# Altium project ImageSignalProcessor.PrjPcb
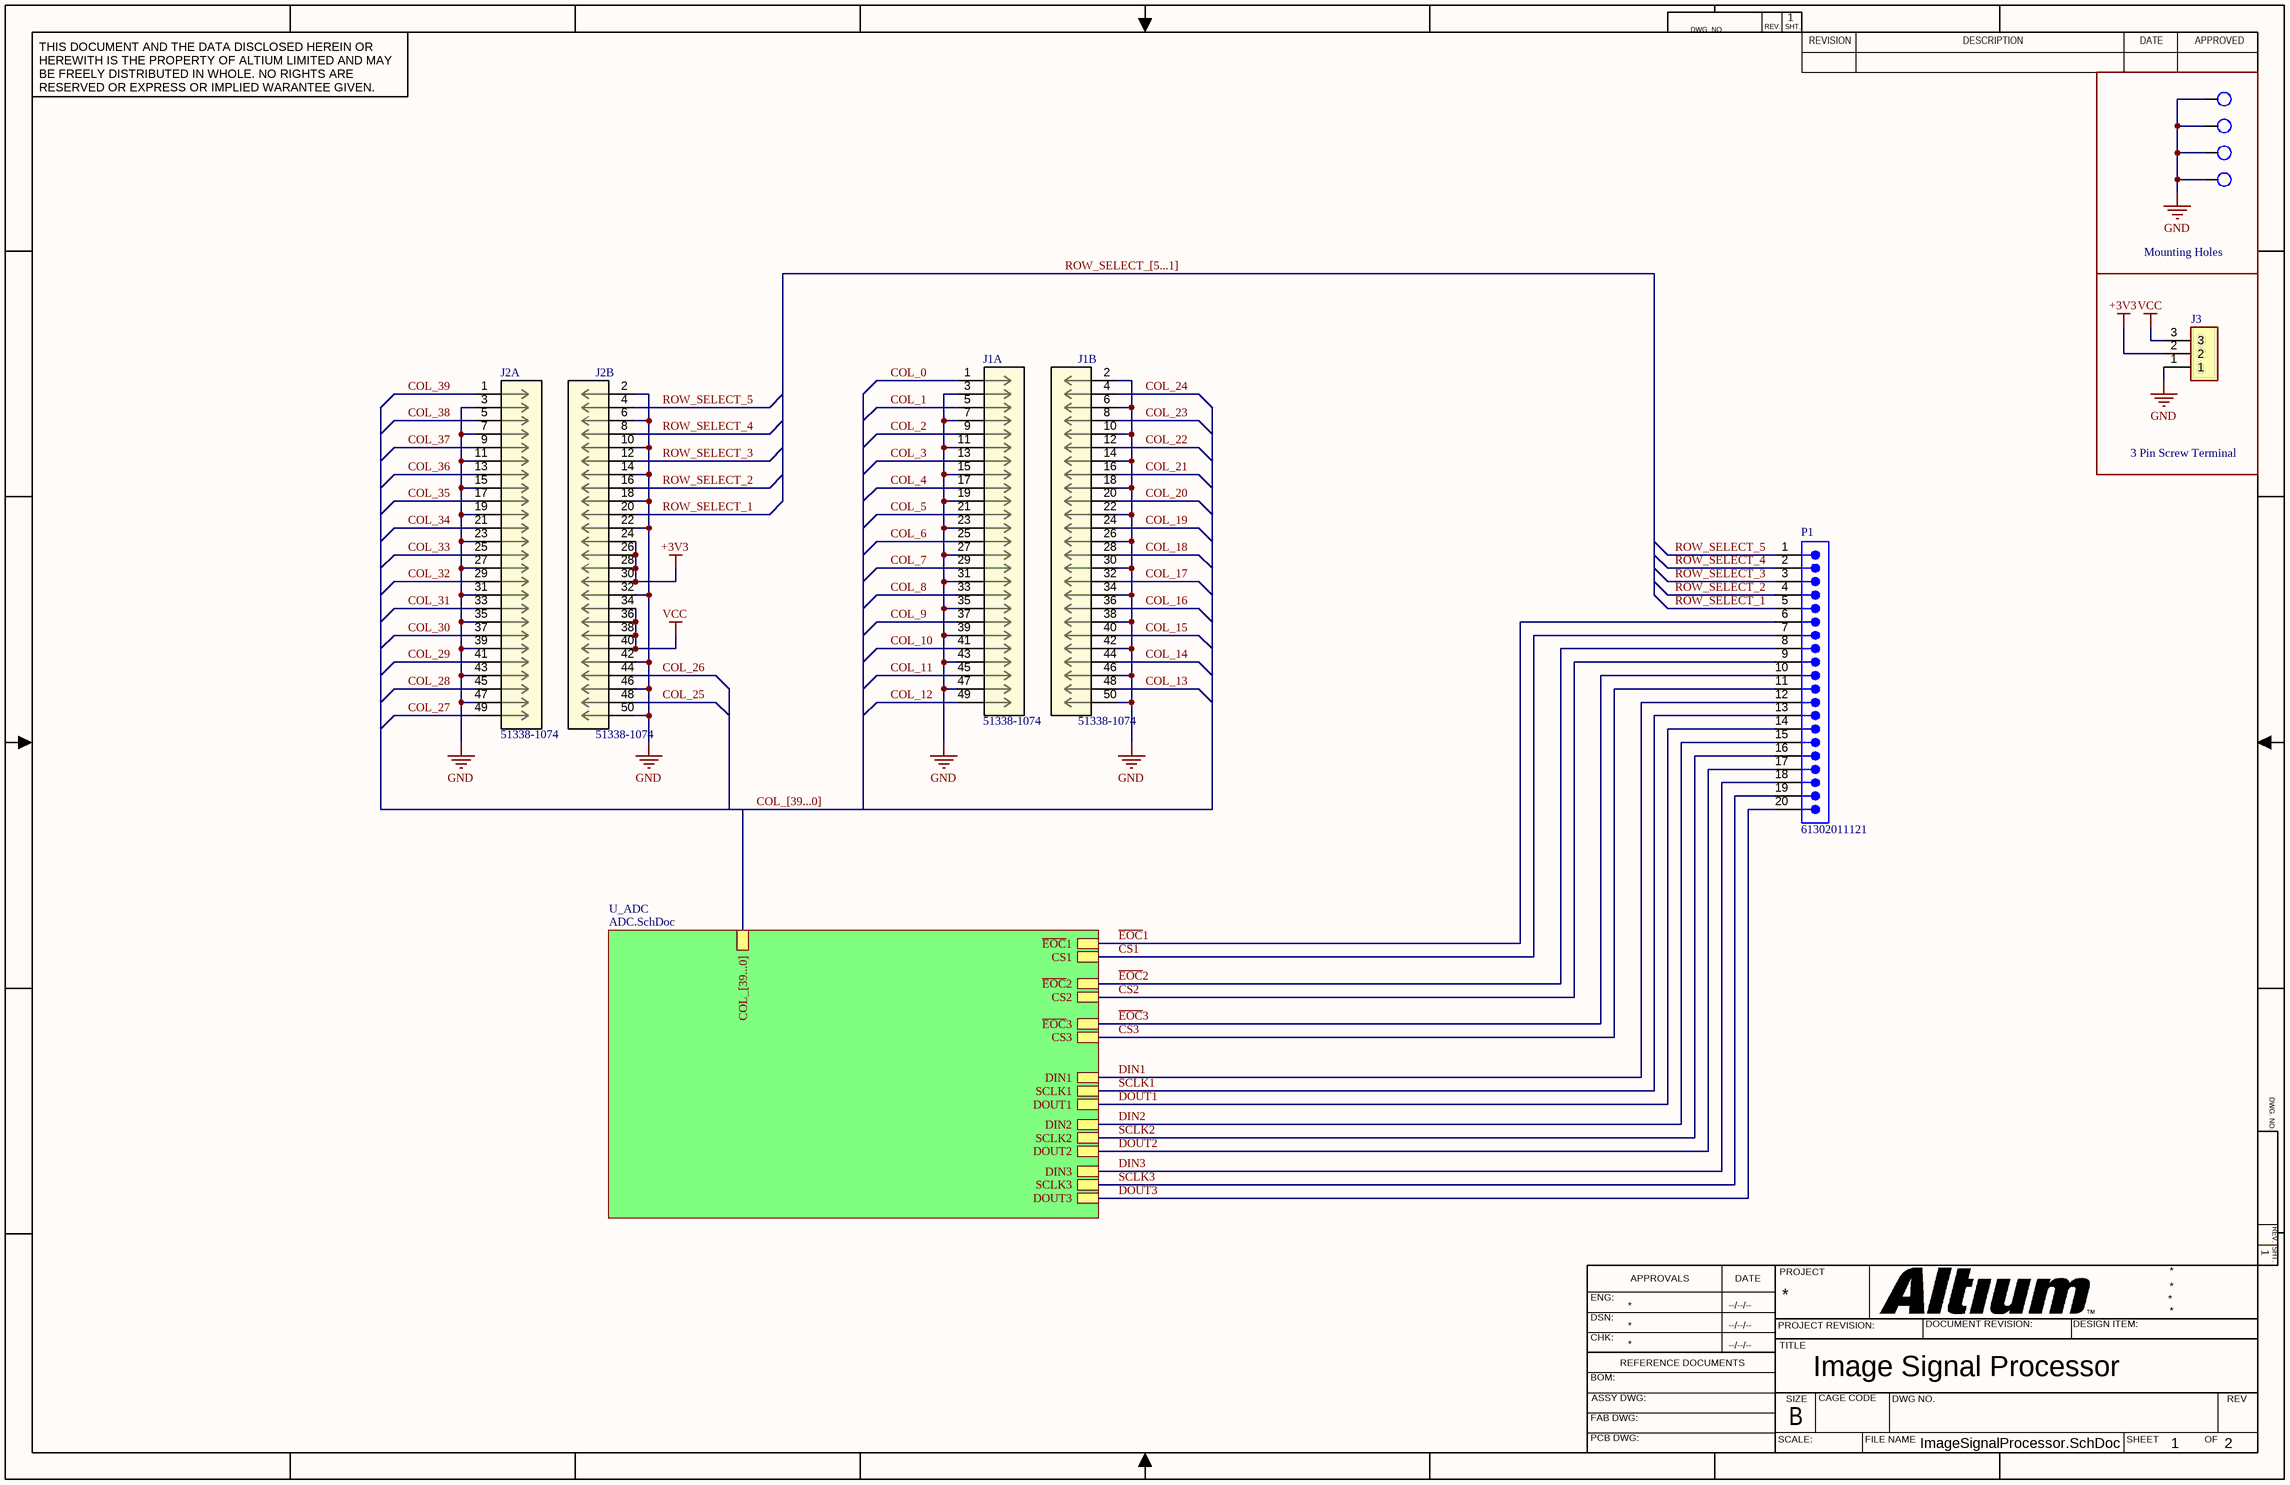
[diagram p0: ImageSignalProcessor.SchDoc]
2 sheets, 17 parts. Net scope: global (net labels, ports and power ports of the same name join across sheets).
Board file: ImageSignalProcessor.PcbDoc
Sheets:
  ImageSignalProcessor.SchDoc
    U_ADC = ADC.SchDoc

## Sheet ImageSignalProcessor.SchDoc: Image Signal Processor
size 431 x 279 mm; Date: 9/19/2023; Revision: 1; SheetNumber: 1; SheetTotal: 2; ENG_APP_DATE: --/--/--; DSN_APP_DATE: --/--/--; CHK_APP_DATE: --/--/--

### Parts
J1  51338-1074  [51338-1074]  (parts A,B of 2)
J2  51338-1074  [51338-1074]  (parts A,B of 2)
J3  3 Pin Screw Terminal  [TE_282837-3]  (value not drawn)
MP1  M3 MOUNTING HOLE  [M3 MOUNTING HOLE]  (value not drawn)
MP2  M3 MOUNTING HOLE  [M3 MOUNTING HOLE]  (value not drawn)
MP3  M3 MOUNTING HOLE  [M3 MOUNTING HOLE]  (value not drawn)
MP4  M3 MOUNTING HOLE  [M3 MOUNTING HOLE]  (value not drawn)
P1  61302011121  [61302011121]

### Blocks framed on the sheet
Mounting Holes: MP1-MP4
3 Pin Screw Terminal: J3

### Sub-sheets
U_ADC = ADC.SchDoc: COL_[39...0], ~{EOC}1, ~{EOC}2, ~{EOC}3, CS1, CS2, CS3, DIN1, SCLK1, DOUT1, DIN2, SCLK2, DOUT2, DIN3, SCLK3, DOUT3

### Nets
+3V3: J2.24 J2.26 J2.28 J2.30 J3.2
GND: J1.2 J1.3 J1.6 J1.7 J1.10 J1.11 J1.14 J1.15 J1.18 J1.19 J1.22 J1.23 J1.26 J1.27 J1.30 J1.31 J1.34 J1.35 J1.38 J1.39 J1.42 J1.43 J1.46 J1.47 J1.50 J2.2 J2.3 J2.6 J2.7 J2.10 J2.11 J2.14 J2.15 J2.18 J2.19 J2.22 J2.23 J2.27 J2.31 J2.32 J2.35 J2.39 J2.42 J2.43 J2.46 J2.47 J2.50 J3.1 MP1.1 MP2.1 MP3.1 MP4.1
VCC: J2.34 J2.36 J2.38 J2.40 J3.3
~{EOC}1: P1.6 ; sheet U_ADC/~{EOC}1
~{EOC}2: P1.8 ; sheet U_ADC/~{EOC}2
~{EOC}3: P1.10 ; sheet U_ADC/~{EOC}3
COL_0: J1.1
COL_1: J1.5
COL_2: J1.9
COL_3: J1.13
COL_4: J1.17
COL_5: J1.21
COL_6: J1.25
COL_7: J1.29
COL_8: J1.33
COL_9: J1.37
COL_10: J1.41
COL_11: J1.45
COL_12: J1.49
COL_13: J1.48
COL_14: J1.44
COL_15: J1.40
COL_16: J1.36
COL_17: J1.32
COL_18: J1.28
COL_19: J1.24
COL_20: J1.20
COL_21: J1.16
COL_22: J1.12
COL_23: J1.8
COL_24: J1.4
COL_25: J2.48
COL_26: J2.44
COL_27: J2.49
COL_28: J2.45
COL_29: J2.41
COL_30: J2.37
COL_31: J2.33
COL_32: J2.29
COL_33: J2.25
COL_34: J2.21
COL_35: J2.17
COL_36: J2.13
COL_37: J2.9
COL_38: J2.5
COL_39: J2.1
CS1: P1.7 ; sheet U_ADC/CS1
CS2: P1.9 ; sheet U_ADC/CS2
CS3: P1.11 ; sheet U_ADC/CS3
DIN1: P1.12 ; sheet U_ADC/DIN1
DIN2: P1.15 ; sheet U_ADC/DIN2
DIN3: P1.18 ; sheet U_ADC/DIN3
DOUT1: P1.14 ; sheet U_ADC/DOUT1
DOUT2: P1.17 ; sheet U_ADC/DOUT2
DOUT3: P1.20 ; sheet U_ADC/DOUT3
ROW_SELECT_1: J2.20 P1.5
ROW_SELECT_2: J2.16 P1.4
ROW_SELECT_3: J2.12 P1.3
ROW_SELECT_4: J2.8 P1.2
ROW_SELECT_5: J2.4 P1.1
SCLK1: P1.13 ; sheet U_ADC/SCLK1
SCLK2: P1.16 ; sheet U_ADC/SCLK2
SCLK3: P1.19 ; sheet U_ADC/SCLK3

### Buses and harness runs
bus COL_[39...0] = sheet U_ADC/COL_[39...0]
bus ROW_SELECT_[5...1]

### Notes on the sheet
- DWG. NO.
- REV.
- SHT.
- THIS DOCUMENT AND THE DATA DISCLOSED HEREIN OR HEREWITH IS THE PROPERTY OF ALTIUM LIMITED AND MAY BE FREELY DISTRIBUTED IN WHOLE. NO RIGHTS ARE RESERVED OR EXPRESS OR IMPLIED WARANTEE GIVEN.
- REVISION
- DESCRIPTION
- DATE
- APPROVED
- ENG:
- APPROVALS
- PROJECT
- DSN:
- CHK:
- REFERENCE DOCUMENTS
- PROJECT REVISION:
- TITLE
- DOCUMENT REVISION:
- DESIGN ITEM:
- BOM:
- FAB DWG:
- PCB DWG:
- ASSY DWG:
- SCALE:
- SIZE
- B
- CAGE CODE
- FILE NAME
- DWG NO.
- SHEET
- OF
- REV

### Library data of the parts
J1 J2 = 51338-1074: Board Connector, 100 Contact(s), 2 Row(s), Female, Straight, 0.016 inch Pitch, Surface Mount Terminal, Locking, Black Insulator, Receptacle; Manufacturer: Molex; Option: General Purpose; Filter Feature: No; Mating Information: MULTIPLE MATING PARTS AVAILABLE; Number of Rows Loaded: 2; Number of Contacts: 100; Board Mounting Option: FITTING NAIL; Contact Pattern: RECTANGULAR; Contact Resistance: 40mR; Insulation Resistance: 100MR; Number Of Connectors: 1; Rated Current (Signal): 300mA; Body Breadth: 0.134inch; Body Depth: 0.053inch; Body Length: 0.909inch; Mating Contact Row Spacing: 0.043inch; PCB Contact Row Spacing: 1.4986mm; Reference Standard: UL; Reliability: COMMERCIAL; Supplier: Mouser; Supplier Part Number: 538-51338-1074; Manufacturer Part Number: 51338-1074; RoHS: Yes; Category: Headers and Wire Housings; Stock: 1434; Pricing: 1=3.42, 10=3.08, 50=3.08, 100=2.57, 500=2.56, 1000=2.27, 10000=2.27 (USD); Mounting Technology: Board; Contact Finish - Mating: GOLD; Contact Finish - Termination: GOLD; Insulation Color: Black; Insulation Material: Polymer; Min Operating Temperature: -25°C; Max Operating Temperature: 85°C; Connector Type: BOARD CONNECTOR; JESD-609 Code: e4; Contact Gender: Female; Mixed Contacts: No; Mounting Style: STRAIGHT; Termination: SMD/SMT; Body/Shell Style: RECEPTACLE; Number Of PCB Rows: 2; PCB Contact Pattern: RECTANGULAR; Terminal Pitch: 0.4mm; Mating Contact Pitch: 0.016inch; Mounting Option 1: LOCKING; Flammability Rating: UL94 V-0; DIN Conformance: No; IEC Conformance: No; MIL Conformance: No; Reach SVHC Compliant: Yes; RoHS Compliant: Yes; ComponentLink1URL: https://datasheet.ciiva.com:443/pdfs/VipMasterIC/IC/MOLE/MOLE-S-A0003536377/MOLE-S-A0003536377-1.pdf?src-supplier=IHS+Markit; ComponentLink1Description: https://datasheet.ciiva.com:443/pdfs/VipMasterIC/IC/MOLE/MOLE-S-A0003536377/MOLE-S-A0003536377-1.pdf?src-supplier=IHS+Markit; ComponentLink2URL: https://datasheet.ciiva.com/5129/0513381074-pcb-receptacles-149270-5129725.pdf?src-supplier=Mouser; ComponentLink2Description: https://datasheet.ciiva.com/5129/0513381074-pcb-receptacles-149270-5129725.pdf?src-supplier=Mouser; ComponentLink3URL: https://datasheet.ciiva.com/46409/1597556-46409754.pdf?src-supplier=Element14; ComponentLink3Description: https://datasheet.ciiva.com/46409/1597556-46409754.pdf?src-supplier=Element14
J3 = 282837-3: Modular Terminal Block, 13.5A, 1.5mm2, 1 Row(s), 1 Deck(s); Manufacturer: TE Connectivity; Manufacturer Series: 282837; Number of Decks: 1; Number of Ways: 3; Voltage Rating: 300V; Wire/Cable Gauge: 15AWG; Safety Approval: UL; Supplier: Future Electronics; Supplier Part Number: 3579695; Manufacturer Part Number: 282837-3; RoHS: Yes; Category: Terminal Blocks; Stock: 18400; Pricing: 1=0.68, 50=0.66, 200=0.625, 500=0.61, 2000=0.56 (USD); Mounting Technology: Board; Terminal and Terminal Block Type: MODULAR TERMINAL BLOCK; Fastening Method: SCREW; Number of Rows: 1; Current Rating: 13.5A; Wire Cross Section: 1.5mm2; RoHS Compliant: Yes; Reach SVHC Compliant: No; ComponentLink1URL: https://www.te.com:443/usa-en/product-282837-3.html?src-supplier=IHS+Markit; ComponentLink1Description: https://www.te.com:443/usa-en/product-282837-3.html?src-supplier=IHS+Markit; ComponentLink2URL: https://datasheet.ciiva.com/16305/eng-cs-1308389-eurostyle-terminal-blocks-0607-16305250.pdf?src-supplier=Future+Electronics; ComponentLink2Description: https://datasheet.ciiva.com/16305/eng-cs-1308389-eurostyle-terminal-blocks-0607-16305250.pdf?src-supplier=Future+Electronics; ComponentLink3URL: https://datasheet.ciiva.com/11758/0900766b80e7dc97-11758673.pdf?src-supplier=Rs; ComponentLink3Description: https://datasheet.ciiva.com/11758/0900766b80e7dc97-11758673.pdf?src-supplier=Rs; ComponentLink4URL: https://datasheet.ciiva.com/30149/eng-cs-1308389-eurostyle-terminal-blocks-0607-30149775.pdf?src-supplier=Onlinecomponents.com; ComponentLink4Description: https://datasheet.ciiva.com/30149/eng-cs-1308389-eurostyle-terminal-blocks-0607-30149775.pdf?src-supplier=Onlinecomponents.com; ComponentLink5URL: https://datasheet.ciiva.com/3141/eng-cs-1308389-eurostyle-terminal-blocks-0607-3141580.pdf?src-supplier=Avnet; ComponentLink5Description: https://datasheet.ciiva.com/3141/eng-cs-1308389-eurostyle-terminal-blocks-0607-3141580.pdf?src-supplier=Avnet; ComponentLink6URL: https://datasheet.ciiva.com/7978/1650926-7978570.pdf?src-supplier=Element14; ComponentLink6Description: https://datasheet.ciiva.com/7978/1650926-7978570.pdf?src-supplier=Element14; ComponentLink7URL: https://datasheet.ciiva.com/823/eng-cd-282837-g3-823447.pdf?src-supplier=Digi-Key; ComponentLink7Description: https://datasheet.ciiva.com/823/eng-cd-282837-g3-823447.pdf?src-supplier=Digi-Key; ComponentLink8URL: https://datasheet.ciiva.com/18620/eng-cd-282837-g3-18620919.pdf?src-supplier=Digi-Key; ComponentLink8Description: https://datasheet.ciiva.com/18620/eng-cd-282837-g3-18620919.pdf?src-supplier=Digi-Key
P1 = CMP-1502-01102-2: NexarPartId: 32855554; Number of Contacts: 20; Contact Resistance: 20mΩ; Pitch: 2.54mm; Gender: Male; Operating Supply Voltage: 250V; Connector Type: Male Pin; Current Rating: 3A; Packaging: Bulk; RoHS: Compliant; Contact Material: Copper; Contact Mating Length: 5.9944mm; Number of Positions: 20; Orientation: Vertical; Termination: Solder; Number of Pins: 20; Color: Black; REACH SVHC: Unknown; Mount: Through Hole; Contact Plating: Gold; Number of Rows: 1; Lead Pitch: 2.54mm

## Sheet ADC.SchDoc: ADC
size 431 x 279 mm; Date: 19/9/2023; Engineer: Kavi Dey; Revision: 1; SheetNumber: 2; SheetTotal: 2; Project: NeoObscura; ENG_APP_DATE: 9/19/2023; DSN_APP_DATE: --/--/--; CHK_APP_DATE: --/--/--
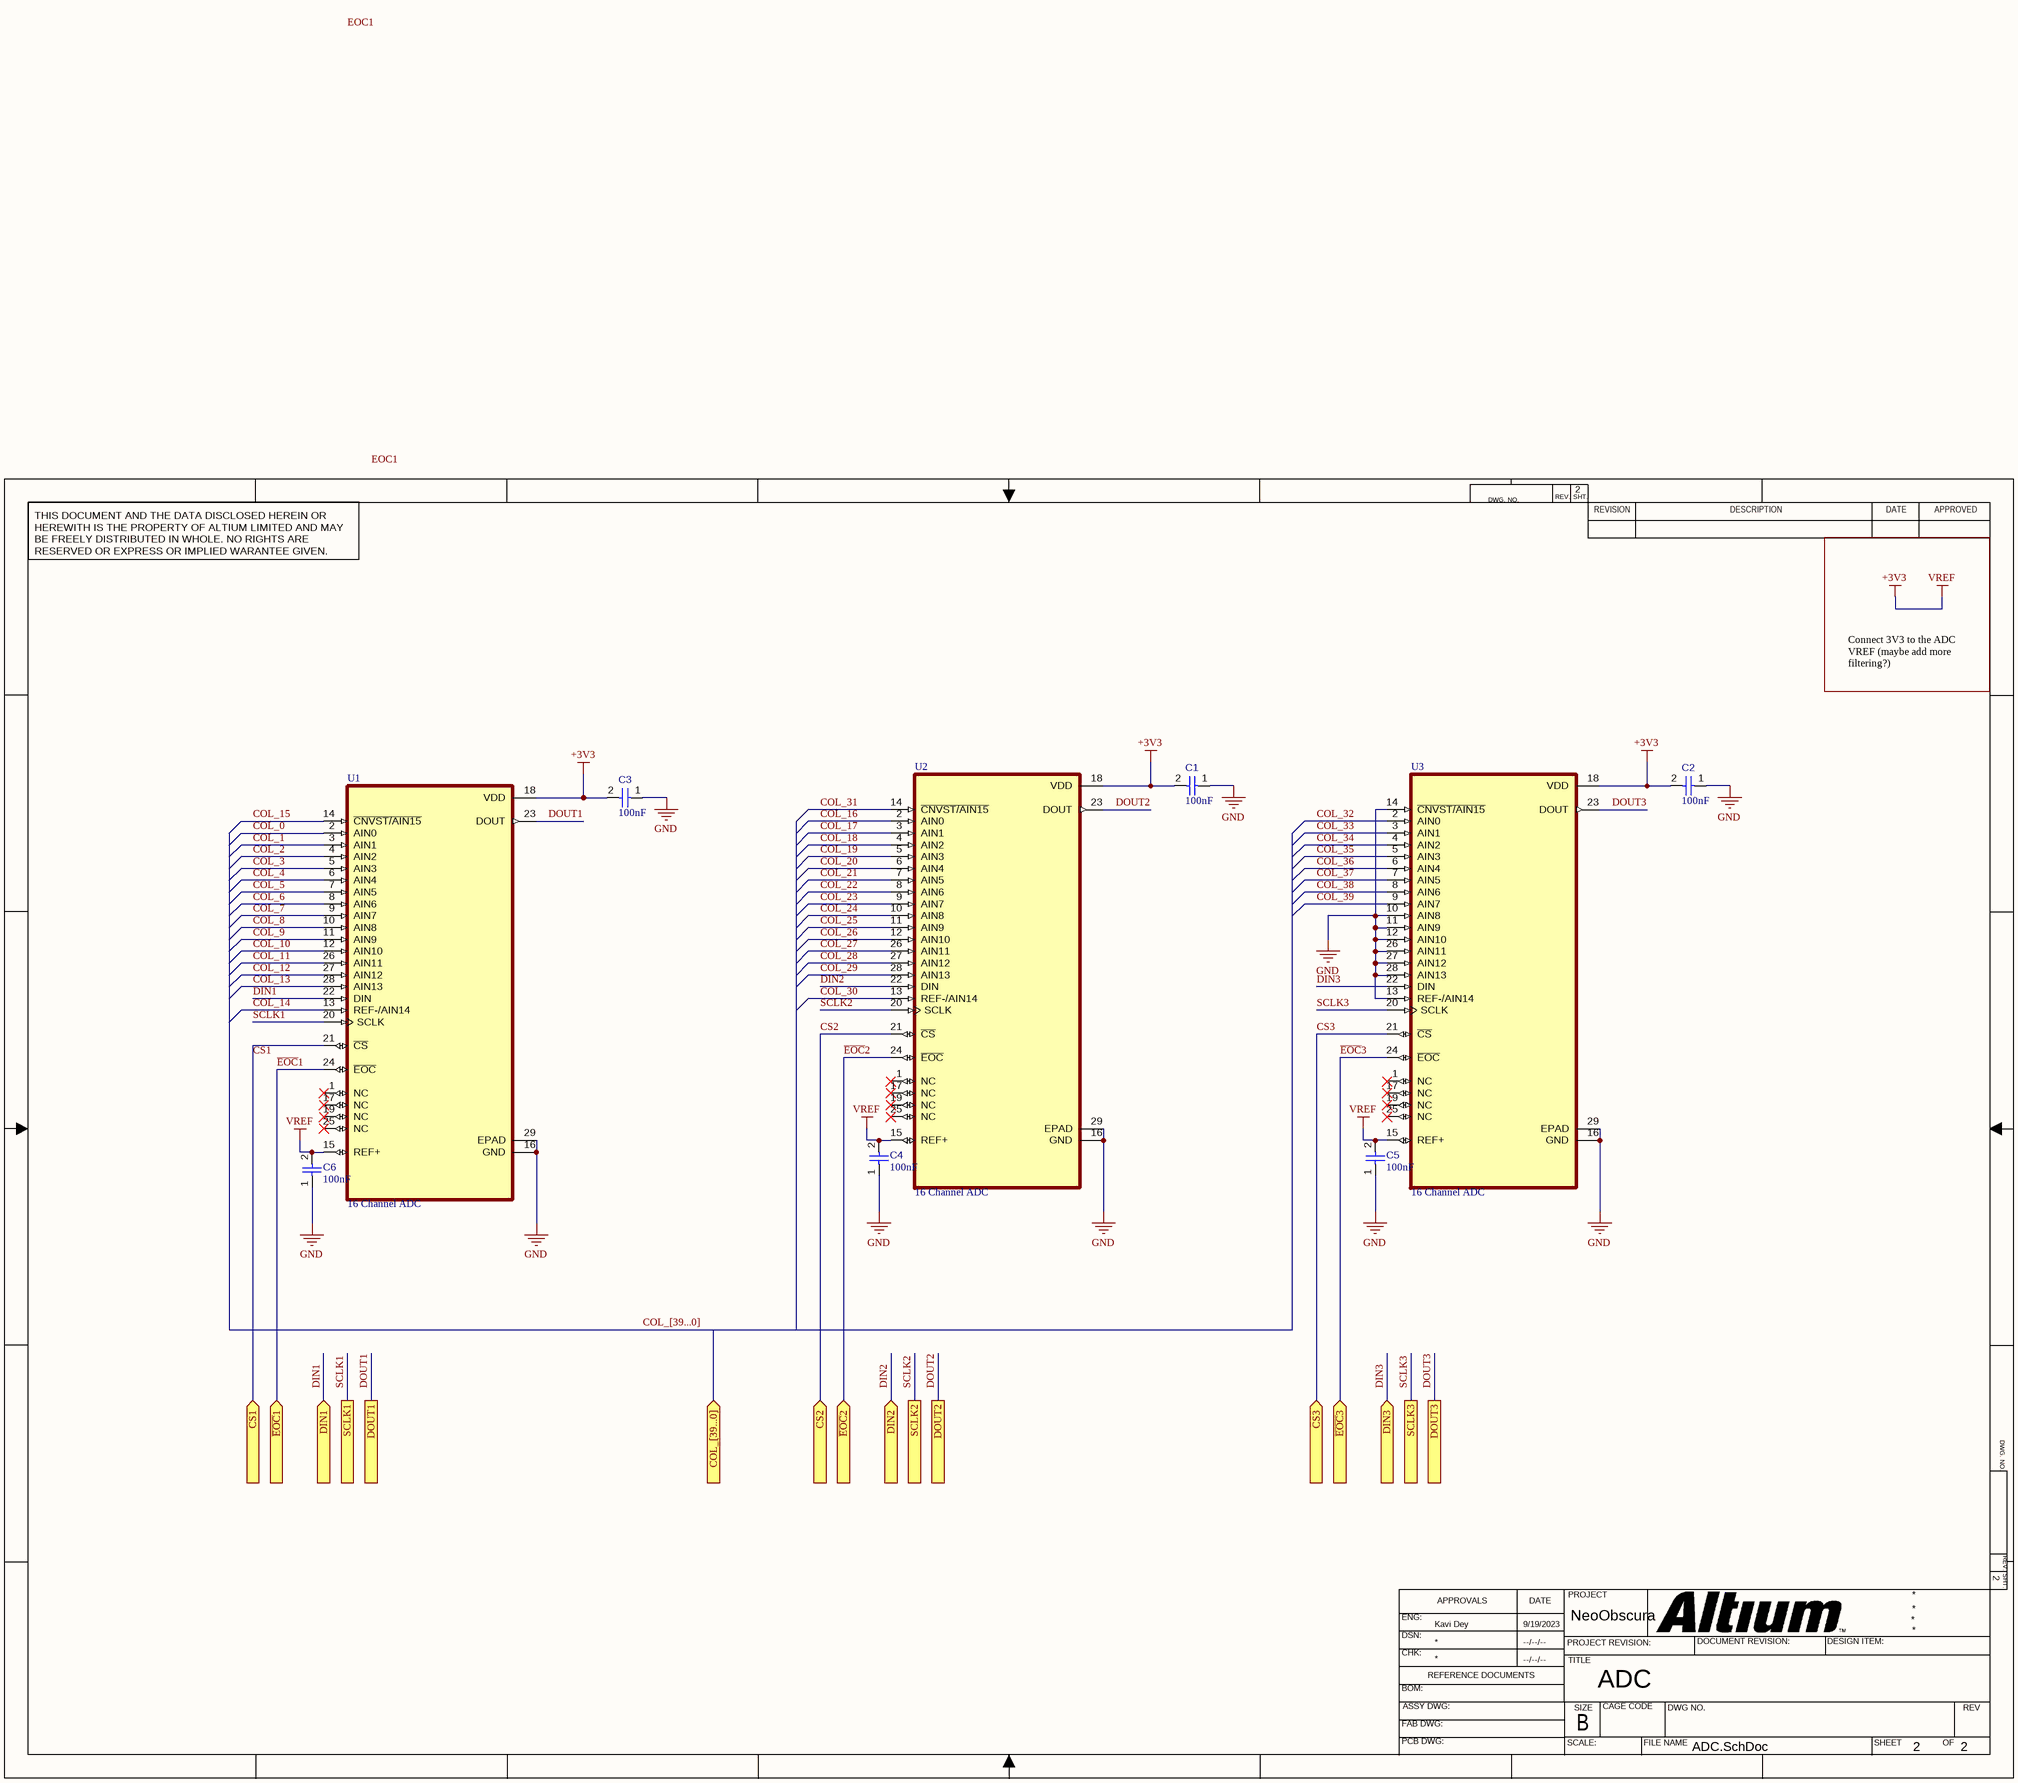
[diagram p1: ADC.SchDoc]

### Parts
C1  value 100nF  [CAPC1005X56X25LL10T15]  (hidden comment: Capacitor 0.1 uF +/- 5% 16 V 0402)
C2  value 100nF  [CAPC1005X56X25LL10T15]  (hidden comment: Capacitor 0.1 uF +/- 5% 16 V 0402)
C3  value 100nF  [CAPC1005X56X25LL10T15]  (hidden comment: Capacitor 0.1 uF +/- 5% 16 V 0402)
C4  value 100nF  [CAPC1005X56X25LL10T15]  (hidden comment: Capacitor 0.1 uF +/- 5% 16 V 0402)
C5  value 100nF  [CAPC1005X56X25LL10T15]  (hidden comment: Capacitor 0.1 uF +/- 5% 16 V 0402)
C6  value 100nF  [CAPC1005X56X25LL10T15]  (hidden comment: Capacitor 0.1 uF +/- 5% 16 V 0402)
U1  16 Channel ADC  [QFN50P500X500X80-29N]
U2  16 Channel ADC  [QFN50P500X500X80-29N]
U3  16 Channel ADC  [QFN50P500X500X80-29N]

### Ports
COL_[39...0] (in), CS1 (in), CS2 (in), CS3 (in), DIN1 (in), DIN2 (in), DIN3 (in), DOUT1, DOUT2, DOUT3, SCLK1, SCLK2, SCLK3, ~{EOC}1 (in), ~{EOC}2 (in), ~{EOC}3 (in)

### Nets
+3V3: C1.2 C2.2 C3.2 C4.2 C5.2 C6.2 U1.15(REF+) U1.18(VDD) U2.15(REF+) U2.18(VDD) U3.15(REF+) U3.18(VDD)  [also labelled VREF]
GND: C1.1 C2.1 C3.1 C4.1 C5.1 C6.1 U1.16(GND) U1.29(EPAD) U2.16(GND) U2.29(EPAD) U3.10(AIN8) U3.11(AIN9) U3.12(AIN10) U3.13(REF-/AIN14) U3.14(~{CNVST/AIN15}) U3.16(GND) U3.26(AIN11) U3.27(AIN12) U3.28(AIN13) U3.29(EPAD)
~{EOC}1: U1.24(~{EOC}) ; port ~{EOC}1
~{EOC}2: U2.24(~{EOC}) ; port ~{EOC}2
~{EOC}3: U3.24(~{EOC}) ; port ~{EOC}3
COL_0: U1.2(AIN0)
COL_1: U1.3(AIN1)
COL_2: U1.4(AIN2)
COL_3: U1.5(AIN3)
COL_4: U1.6(AIN4)
COL_5: U1.7(AIN5)
COL_6: U1.8(AIN6)
COL_7: U1.9(AIN7)
COL_8: U1.10(AIN8)
COL_9: U1.11(AIN9)
COL_10: U1.12(AIN10)
COL_11: U1.26(AIN11)
COL_12: U1.27(AIN12)
COL_13: U1.28(AIN13)
COL_14: U1.13(REF-/AIN14)
COL_15: U1.14(~{CNVST/AIN15})
COL_16: U2.2(AIN0)
COL_17: U2.3(AIN1)
COL_18: U2.4(AIN2)
COL_19: U2.5(AIN3)
COL_20: U2.6(AIN4)
COL_21: U2.7(AIN5)
COL_22: U2.8(AIN6)
COL_23: U2.9(AIN7)
COL_24: U2.10(AIN8)
COL_25: U2.11(AIN9)
COL_26: U2.12(AIN10)
COL_27: U2.26(AIN11)
COL_28: U2.27(AIN12)
COL_29: U2.28(AIN13)
COL_30: U2.13(REF-/AIN14)
COL_31: U2.14(~{CNVST/AIN15})
COL_32: U3.2(AIN0)
COL_33: U3.3(AIN1)
COL_34: U3.4(AIN2)
COL_35: U3.5(AIN3)
COL_36: U3.6(AIN4)
COL_37: U3.7(AIN5)
COL_38: U3.8(AIN6)
COL_39: U3.9(AIN7)
CS1: U1.21(~{CS}) ; port CS1
CS2: U2.21(~{CS}) ; port CS2
CS3: U3.21(~{CS}) ; port CS3
DIN1: U1.22(DIN) ; port DIN1
DIN2: U2.22(DIN) ; port DIN2
DIN3: U3.22(DIN) ; port DIN3
DOUT1: U1.23(DOUT) ; port DOUT1
DOUT2: U2.23(DOUT) ; port DOUT2
DOUT3: U3.23(DOUT) ; port DOUT3
SCLK1: U1.20(SCLK) ; port SCLK1
SCLK2: U2.20(SCLK) ; port SCLK2
SCLK3: U3.20(SCLK) ; port SCLK3

Not connected (* = marked no-connect by the designer): U1 1(NC)* 17(NC)* 19(NC)* 25(NC)*; U2 1(NC)* 17(NC)* 19(NC)* 25(NC)*; U3 1(NC)* 17(NC)* 19(NC)* 25(NC)*

### Buses and harness runs
bus COL_[39...0] = port COL_[39...0]

### Notes on the sheet
- Connect 3V3 to the ADC VREF (maybe add more filtering?)
- Labels drawn without touching a wire or pin: EOC1
- DWG. NO.
- REV.
- SHT.
- THIS DOCUMENT AND THE DATA DISCLOSED HEREIN OR HEREWITH IS THE PROPERTY OF ALTIUM LIMITED AND MAY BE FREELY DISTRIBUTED IN WHOLE. NO RIGHTS ARE RESERVED OR EXPRESS OR IMPLIED WARANTEE GIVEN.
- REVISION
- DESCRIPTION
- DATE
- APPROVED
- ENG:
- APPROVALS
- PROJECT
- DSN:
- CHK:
- REFERENCE DOCUMENTS
- PROJECT REVISION:
- TITLE
- DOCUMENT REVISION:
- DESIGN ITEM:
- BOM:
- FAB DWG:
- PCB DWG:
- ASSY DWG:
- SCALE:
- SIZE
- B
- CAGE CODE
- FILE NAME
- DWG NO.
- SHEET
- OF
- REV

### Library data of the parts
C1-C6 = CMP-001-00001-6: Chip Capacitor, 0.1 uF, +/- 5%, 16 V, 0402 (1005 Metric); Capacitor Type: Ceramic; Voltage Rating: 16V; Max Operating Temperature: 125°C; Min Operating Temperature: -55°C; Case/Package: 0402; Mounting Technology: SM; Pins: 2; Tolerance: 5%; RoHS Compliant: True
U1-U3 = MAX1031BETI+T: ADC, Successive Approximation, 10-Bit, 1 Func, 16 Channel, Serial Access, BICMOS; Manufacturer: Maxim; Max Input Voltage (AC): 1.26V; Min Input Voltage (AC): -1.24V; Linearity Error-Max (EL): 0.0977%; Number of Analog In Channels: 16; Number of Bits: 10; Channels: 1; Output Bit Code: BINARY, 2''S COMPLEMENT BINARY; Power Supplies: 3/3.3V; Sample Rate (Hz): 300kHz; Sample-and-Hold/Track-and-Hold: TRACK; Conversion Time-Max: 3.5us; Nominal Supply Voltage: 2.7V; Time @ Peak Reflow Temperature-Max (s): 30s; Qualification Status: Not Qualified; Supplier: Digi-Key; Supplier Part Number: MAX1031BETI+T-ND; Manufacturer Part Number: MAX1031BETI+T; RoHS: Yes; Category: Analog to Digital Converters (ADCs); Pricing: 2500=12.50138 (USD); Case/Package: HVQCCN; Pins: 28; Package Shape: Square; Terminal Finish: Tin; Min Operating Temperature: -40°C; Max Operating Temperature: 85°C; JESD-609 Code: e3; Output Format: Serial; Converter Type: SUCCESSIVE APPROXIMATION; Moisture Sensitivity Level: 1; Package Style: CHIP CARRIER, HEAT SINK/SLUG, VERY THIN PROFILEMeter; Peak Reflow Temperature (Cel): 260°C; Surface Mount: Yes; Technology: BICMOS; Terminal Form: No Lead; Terminal Position: QUAD; Length: 5mm; Width: 5mm; Height - Seated (Max): 0.8mm; Terminal Pitch: 0.5mm; Temperature Grade: INDUSTRIAL; Reach SVHC Compliant: Yes; RoHS Compliant: Yes; ComponentLink1URL: https://datasheet.ciiva.com:443/pdfs/VipMasterIC/IC/MAXM/MAXMS12063/MAXMS12063-1.pdf?src-supplier=IHS+Markit; ComponentLink1Description: https://datasheet.ciiva.com:443/pdfs/VipMasterIC/IC/MAXM/MAXMS12063/MAXMS12063-1.pdf?src-supplier=IHS+Markit; ComponentLink2URL: https://datasheet.ciiva.com/1317/max1027-max1031-1317413.pdf?src-supplier=Digi-Key; ComponentLink2Description: https://datasheet.ciiva.com/1317/max1027-max1031-1317413.pdf?src-supplier=Digi-Key; ComponentLink3URL: https://datasheet.ciiva.com/13060/max1027-max1031-94739-13060424.pdf?src-supplier=Mouser; ComponentLink3Description: https://datasheet.ciiva.com/13060/max1027-max1031-94739-13060424.pdf?src-supplier=Mouser

## Nets that join several sheets
+3V3: ImageSignalProcessor (5 pins), ADC (12 pins)
GND: ImageSignalProcessor (52 pins), ADC (20 pins)
~{EOC}1: ImageSignalProcessor (P1.6), ADC (U1.24)
~{EOC}2: ImageSignalProcessor (P1.8), ADC (U2.24)
~{EOC}3: ImageSignalProcessor (P1.10), ADC (U3.24)
COL_0: ImageSignalProcessor (J1.1), ADC (U1.2)
COL_1: ImageSignalProcessor (J1.5), ADC (U1.3)
COL_2: ImageSignalProcessor (J1.9), ADC (U1.4)
COL_3: ImageSignalProcessor (J1.13), ADC (U1.5)
COL_4: ImageSignalProcessor (J1.17), ADC (U1.6)
COL_5: ImageSignalProcessor (J1.21), ADC (U1.7)
COL_6: ImageSignalProcessor (J1.25), ADC (U1.8)
COL_7: ImageSignalProcessor (J1.29), ADC (U1.9)
COL_8: ImageSignalProcessor (J1.33), ADC (U1.10)
COL_9: ImageSignalProcessor (J1.37), ADC (U1.11)
COL_10: ImageSignalProcessor (J1.41), ADC (U1.12)
COL_11: ImageSignalProcessor (J1.45), ADC (U1.26)
COL_12: ImageSignalProcessor (J1.49), ADC (U1.27)
COL_13: ImageSignalProcessor (J1.48), ADC (U1.28)
COL_14: ImageSignalProcessor (J1.44), ADC (U1.13)
COL_15: ImageSignalProcessor (J1.40), ADC (U1.14)
COL_16: ImageSignalProcessor (J1.36), ADC (U2.2)
COL_17: ImageSignalProcessor (J1.32), ADC (U2.3)
COL_18: ImageSignalProcessor (J1.28), ADC (U2.4)
COL_19: ImageSignalProcessor (J1.24), ADC (U2.5)
COL_20: ImageSignalProcessor (J1.20), ADC (U2.6)
COL_21: ImageSignalProcessor (J1.16), ADC (U2.7)
COL_22: ImageSignalProcessor (J1.12), ADC (U2.8)
COL_23: ImageSignalProcessor (J1.8), ADC (U2.9)
COL_24: ImageSignalProcessor (J1.4), ADC (U2.10)
COL_25: ImageSignalProcessor (J2.48), ADC (U2.11)
COL_26: ImageSignalProcessor (J2.44), ADC (U2.12)
COL_27: ImageSignalProcessor (J2.49), ADC (U2.26)
COL_28: ImageSignalProcessor (J2.45), ADC (U2.27)
COL_29: ImageSignalProcessor (J2.41), ADC (U2.28)
COL_30: ImageSignalProcessor (J2.37), ADC (U2.13)
COL_31: ImageSignalProcessor (J2.33), ADC (U2.14)
COL_32: ImageSignalProcessor (J2.29), ADC (U3.2)
COL_33: ImageSignalProcessor (J2.25), ADC (U3.3)
COL_34: ImageSignalProcessor (J2.21), ADC (U3.4)
COL_35: ImageSignalProcessor (J2.17), ADC (U3.5)
COL_36: ImageSignalProcessor (J2.13), ADC (U3.6)
COL_37: ImageSignalProcessor (J2.9), ADC (U3.7)
COL_38: ImageSignalProcessor (J2.5), ADC (U3.8)
COL_39: ImageSignalProcessor (J2.1), ADC (U3.9)
CS1: ImageSignalProcessor (P1.7), ADC (U1.21)
CS2: ImageSignalProcessor (P1.9), ADC (U2.21)
CS3: ImageSignalProcessor (P1.11), ADC (U3.21)
DIN1: ImageSignalProcessor (P1.12), ADC (U1.22)
DIN2: ImageSignalProcessor (P1.15), ADC (U2.22)
DIN3: ImageSignalProcessor (P1.18), ADC (U3.22)
DOUT1: ImageSignalProcessor (P1.14), ADC (U1.23)
DOUT2: ImageSignalProcessor (P1.17), ADC (U2.23)
DOUT3: ImageSignalProcessor (P1.20), ADC (U3.23)
SCLK1: ImageSignalProcessor (P1.13), ADC (U1.20)
SCLK2: ImageSignalProcessor (P1.16), ADC (U2.20)
SCLK3: ImageSignalProcessor (P1.19), ADC (U3.20)